# Altium schematic sheet 大风车灯条.SchDoc
size A4
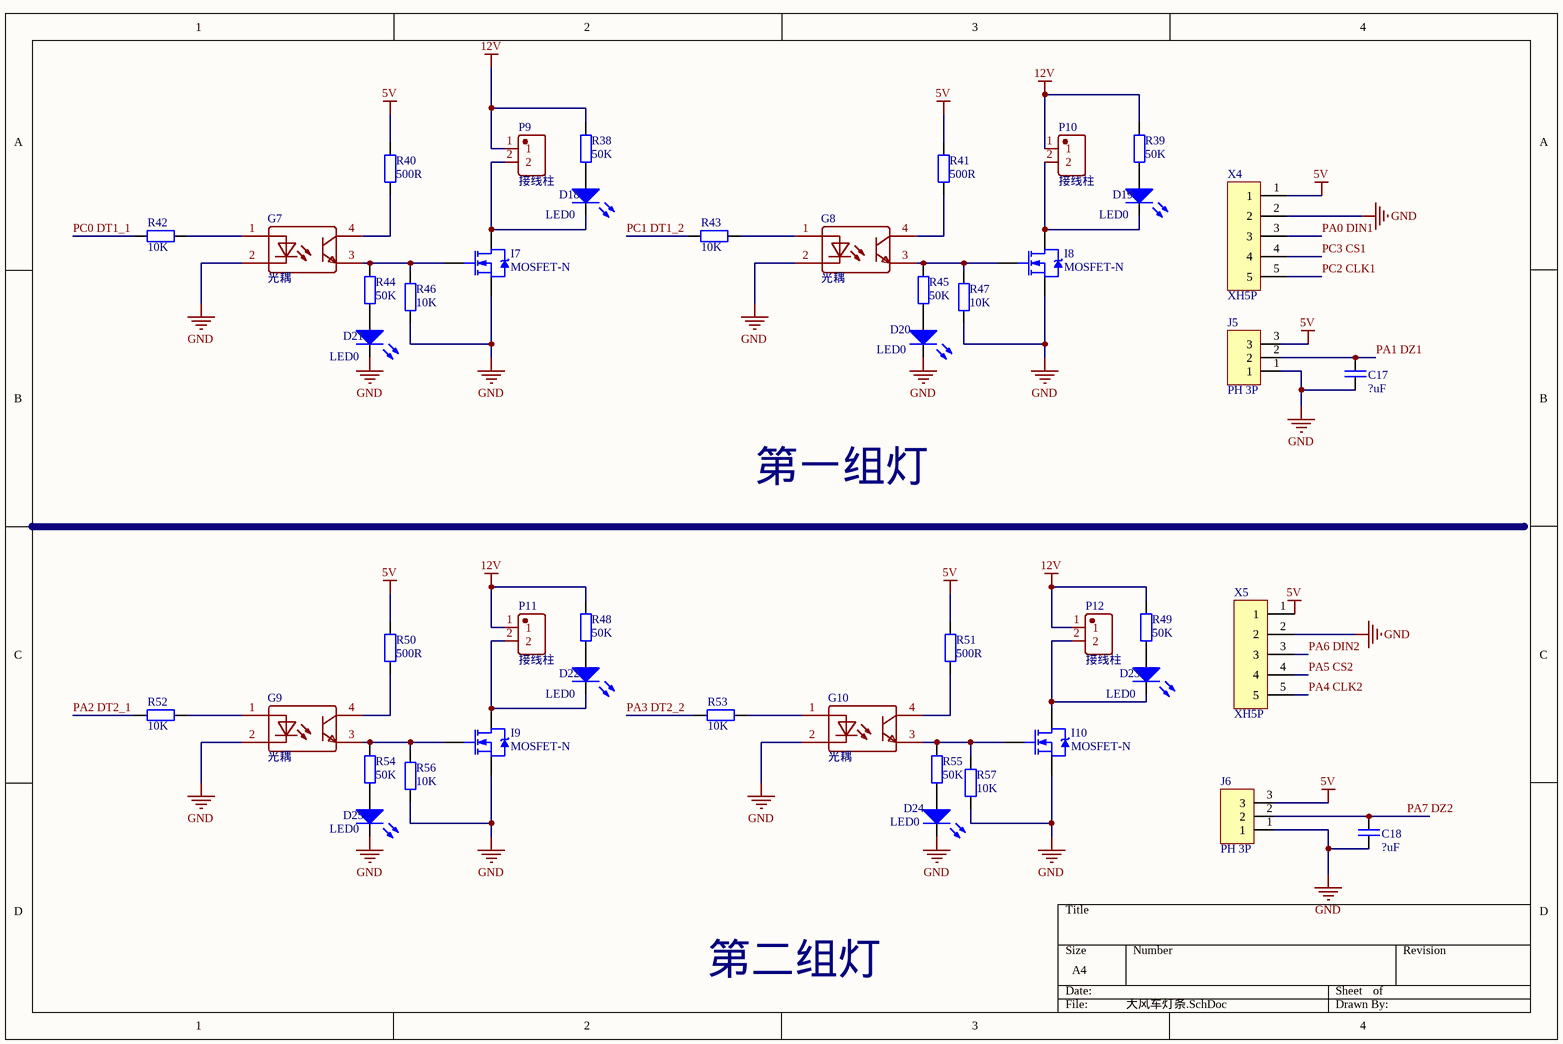
[diagram p0: 大风车灯条.SchDoc]

## Parts
C17  ?uF  [0603_C]
C18  ?uF  [0603_C]
D18  LED0  [LED-0603]
D19  LED0  [LED-0603]
D20  LED0  [LED-0603]
D21  LED0  [LED-0603]
D22  LED0  [LED-0603]
D23  LED0  [LED-0603]
D24  LED0  [LED-0603]
D25  LED0  [LED-0603]
G7  光耦  [SMD-4]
G8  光耦  [SMD-4]
G9  光耦  [SMD-4]
G10  光耦  [SMD-4]
I7  MOSFET-N  [VSONP-8]
I8  MOSFET-N  [VSONP-8]
I9  MOSFET-N  [VSONP-8]
I10  MOSFET-N  [VSONP-8]
J5  PH 3P  [PH3P]
J6  PH 3P  [PH3P]
P9  接线柱  [XT30-F]
P10  接线柱  [XT30-F]
P11  接线柱  [XT30-F]
P12  接线柱  [XT30-F]
R38  50K  [0603_R]
R39  50K  [0603_R]
R40  500R  [0603_R]
R41  500R  [0603_R]
R42  10K  [0603_R]
R43  10K  [0603_R]
R44  50K  [0603_R]
R45  50K  [0603_R]
R46  10K  [0603_R]
R47  10K  [0603_R]
R48  50K  [0603_R]
R49  50K  [0603_R]
R50  500R  [0603_R]
R51  500R  [0603_R]
R52  10K  [0603_R]
R53  10K  [0603_R]
R54  50K  [0603_R]
R55  50K  [0603_R]
R56  10K  [0603_R]
R57  10K  [0603_R]
X4  XH5P  [XH5P]
X5  XH5P  [XH5P]

## Nets
5V: J5.3 J6.3 R40.2 R41.2 R50.2 R51.2 X4.1 X5.1
12V: P9.1 P10.1 P11.1 P12.1 R38.2 R39.2 R48.2 R49.2
GND: C17.1 C18.1 D20.2(K) D21.2(K) D24.2(K) D25.2(K) G7.2(CAT) G8.2(CAT) G9.2(CAT) G10.2(CAT) I7.S I8.S I9.S I10.S J5.1 J6.1 R46.1 R47.1 R56.1 R57.1 X4.2 X5.2
PA0 DIN1: X4.3
PA1 DZ1: C17.2 J5.2
PA2 DT2_1: R52.1
PA3 DT2_2: R53.1
PA4 CLK2: X5.5
PA5 CS2: X5.4
PA6 DIN2: X5.3
PA7 DZ2: C18.2 J6.2
PC0 DT1_1: R42.1
PC1 DT1_2: R43.1
PC2 CLK1: X4.5
PC3 CS1: X4.4
NetD18_1: D18.1(A) R38.1
NetD18_2: D18.2(K) I7.D P9.2
NetD19_1: D19.1(A) R39.1
NetD19_2: D19.2(K) I8.D P10.2
NetD20_1: D20.1(A) R45.1
NetD21_1: D21.1(A) R44.1
NetD22_1: D22.1(A) R48.1
NetD22_2: D22.2(K) I9.D P11.2
NetD23_1: D23.1(A) R49.1
NetD23_2: D23.2(K) I10.D P12.2
NetD24_1: D24.1(A) R55.1
NetD25_1: D25.1(A) R54.1
NetG7_1: G7.1(AN) R42.2
NetG7_3: G7.3(EM) I7.G R44.2 R46.2
NetG7_4: G7.4(COL) R40.1
NetG8_1: G8.1(AN) R43.2
NetG8_3: G8.3(EM) I8.G R45.2 R47.2
NetG8_4: G8.4(COL) R41.1
NetG9_1: G9.1(AN) R52.2
NetG9_3: G9.3(EM) I9.G R54.2 R56.2
NetG9_4: G9.4(COL) R50.1
NetG10_1: G10.1(AN) R53.2
NetG10_3: G10.3(EM) I10.G R55.2 R57.2
NetG10_4: G10.4(COL) R51.1

## Notes on the sheet
- 第一组灯
- 第二组灯

## Library data of the parts
C17 C18 = Cap: Published: 8-Jun-2000; LatestRevisionDate: 17-Jul-2002; LatestRevisionNote: Re-released for DXP Platform.; PackageReference: RAD-0.3; Publisher: Altium Limited
D18-D25 = LED0: 发光二极管; Published: 8-Jun-2000; LatestRevisionDate: 08-Jul-2005; LatestRevisionNote: Mech Layer 1 removed.; PackageReference: LED-0; Publisher: Altium Limited
R38-R57 = Res: Published: 8-Jun-2000; LatestRevisionDate: 17-Jul-2002; LatestRevisionNote: Re-released for DXP Platform.; PackageReference: AXIAL-0.4; Publisher: Altium Limited